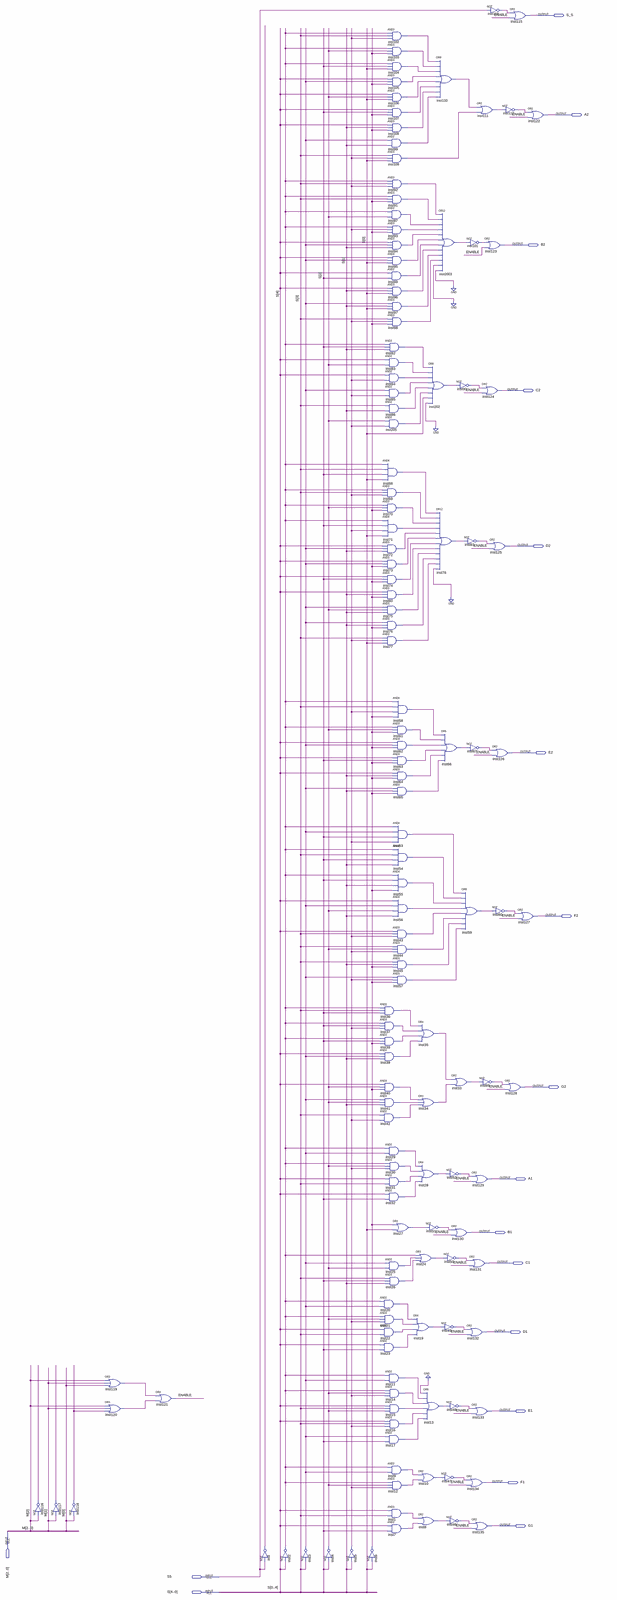
[diagram p0: schematic sheet, whole]
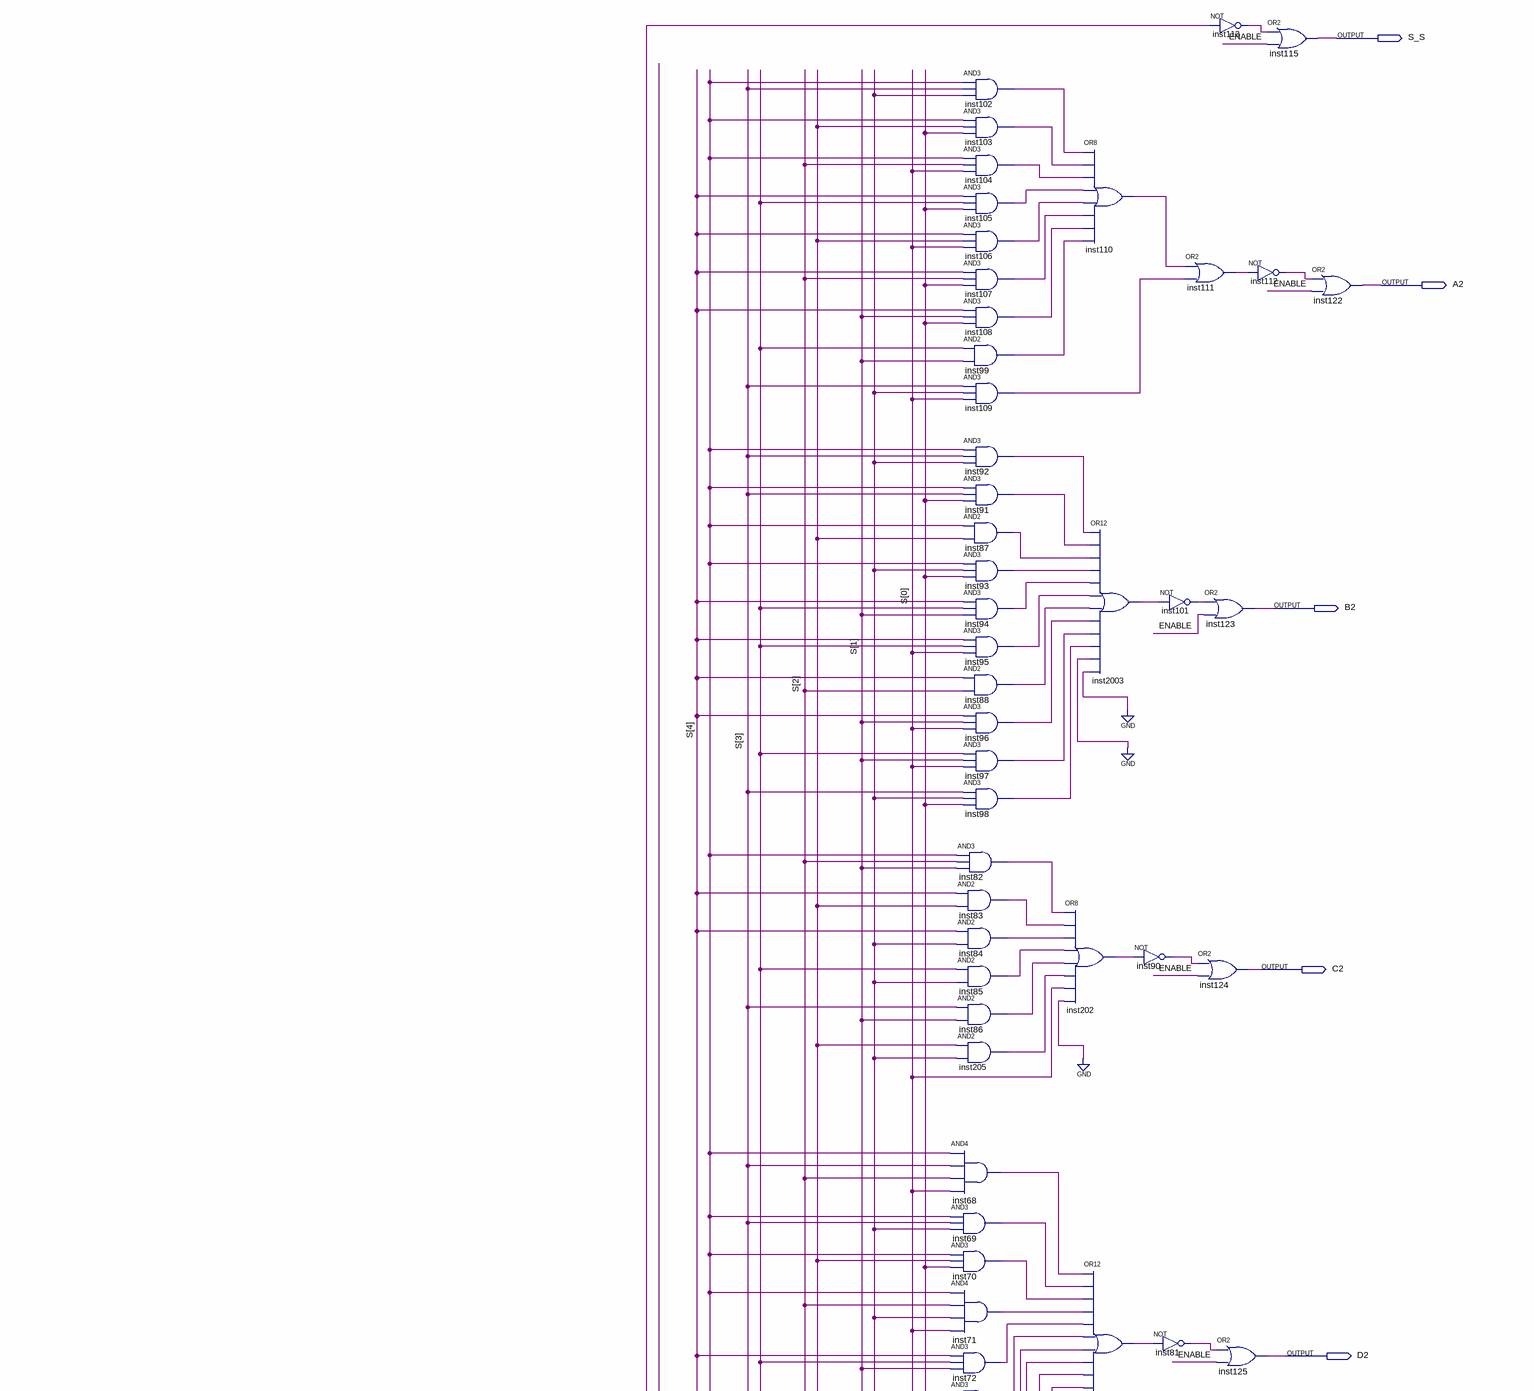
[diagram p1: schematic sheet, upper part]
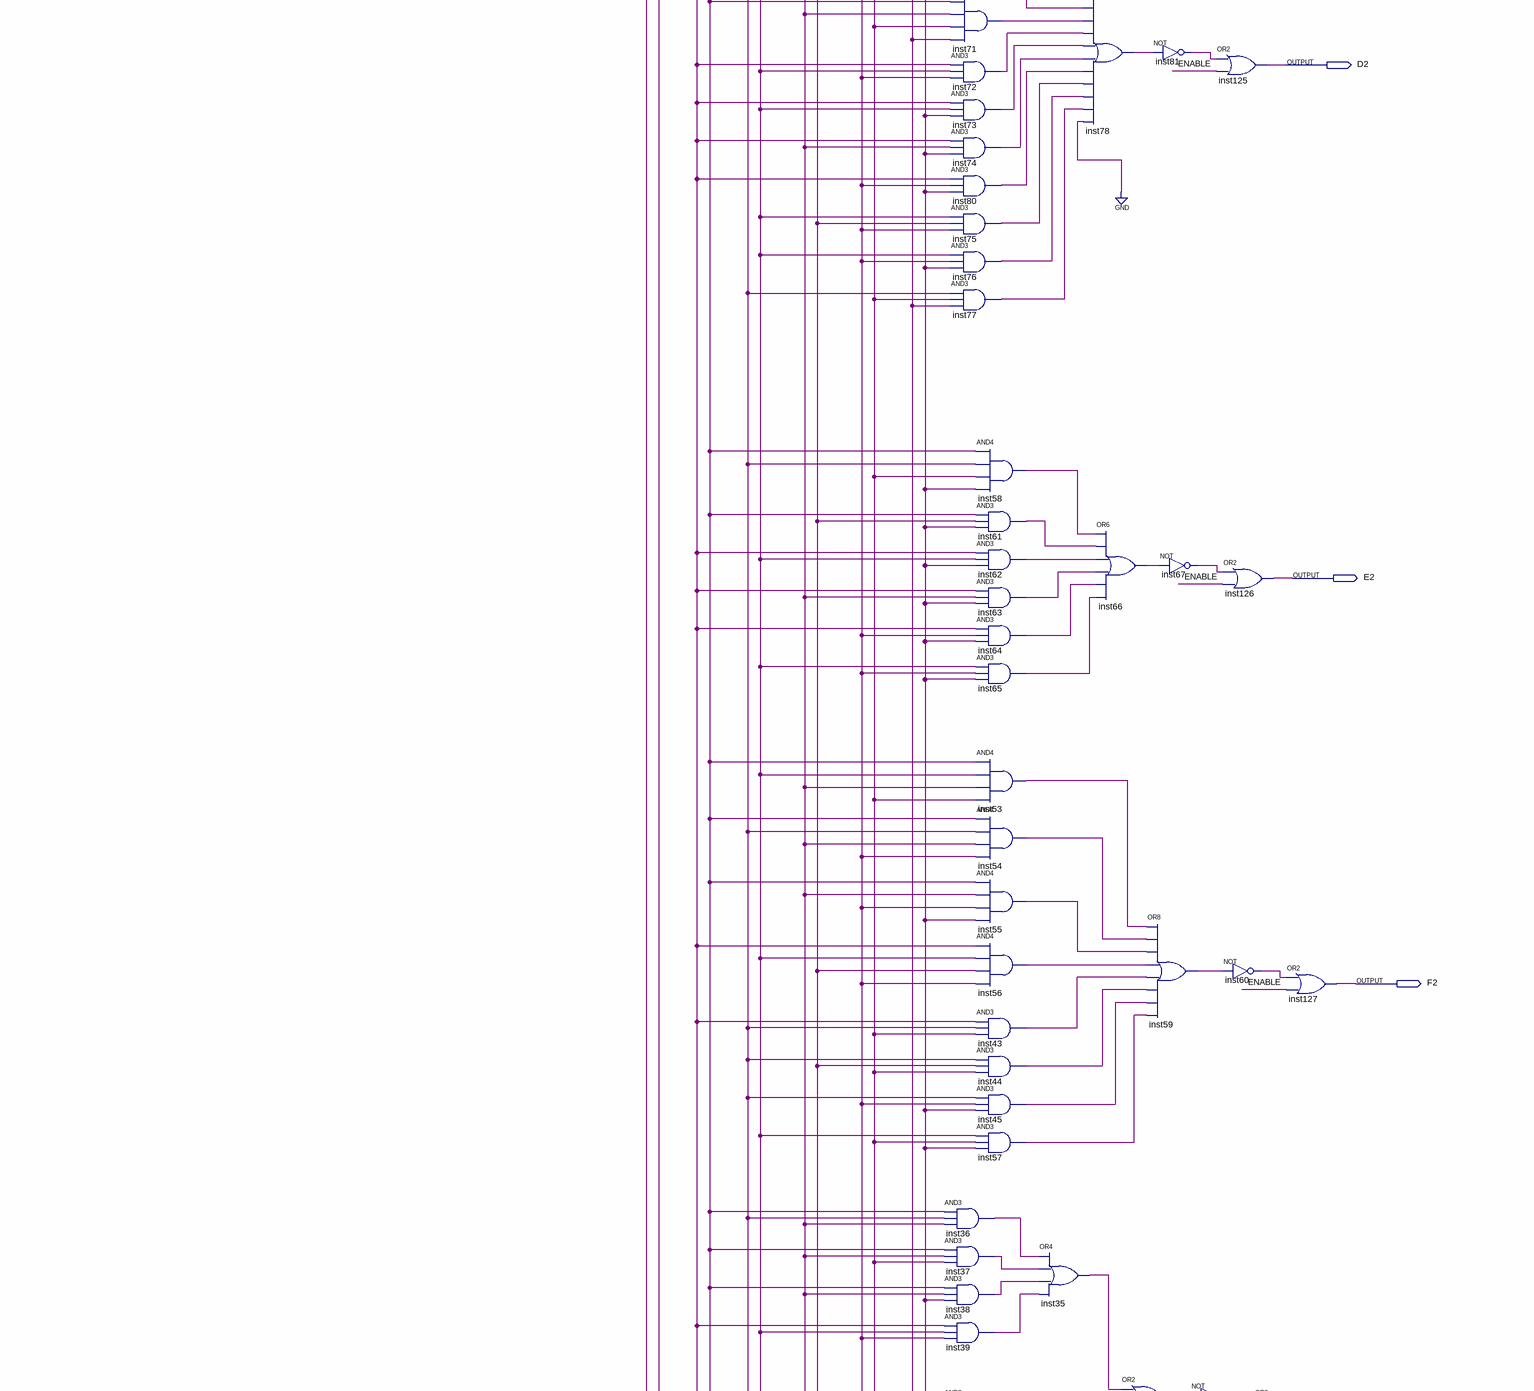
[diagram p2: schematic sheet, middle part]
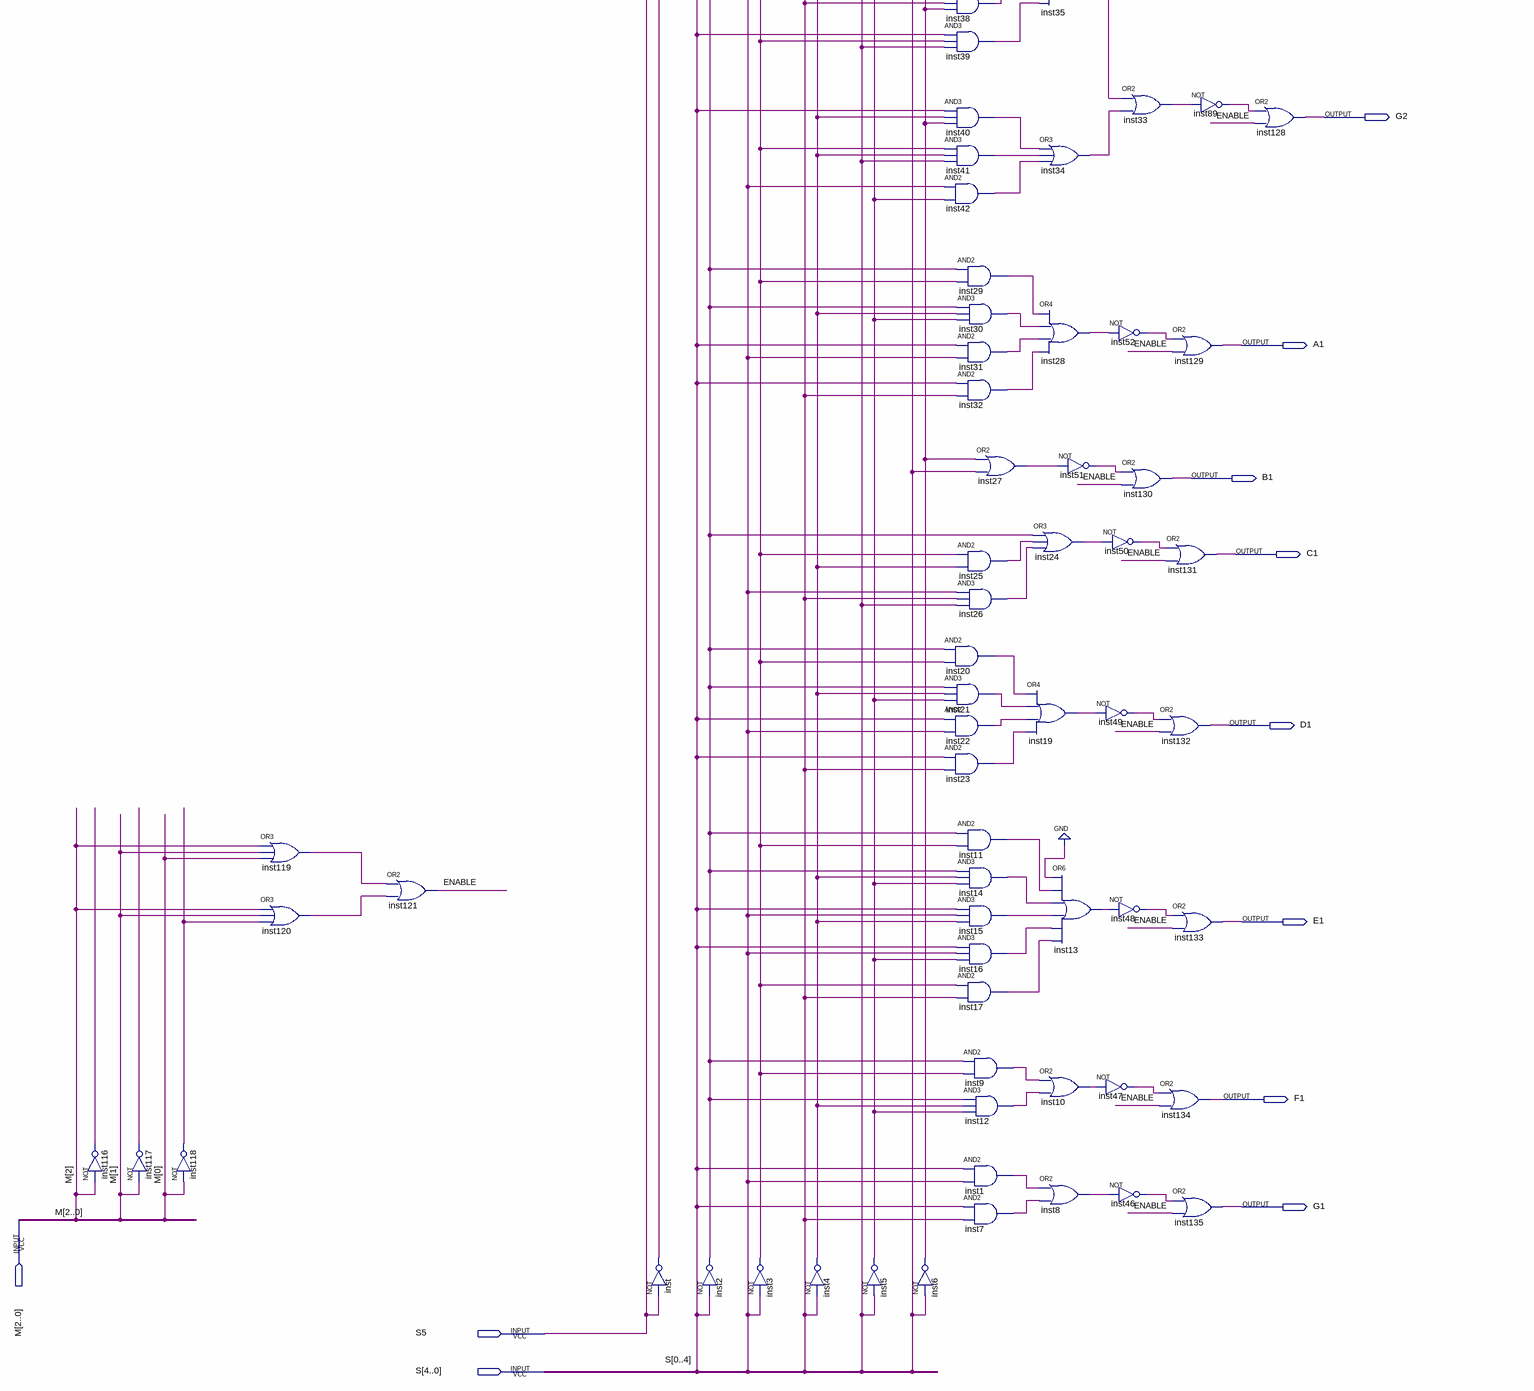
[diagram p3: schematic sheet, lower part]
// Quartus schematic decodificador5bitsDisplay.bdf as structural Verilog: 135 symbols, 18 pins
module decodificador5bitsDisplay (
  input  [2:0] M,
  input  S5,
  input  [4:0] S,
  output S_S,
  output A2,
  output B2,
  output C2,
  output D2,
  output E2,
  output F2,
  output G2,
  output A1,
  output B1,
  output C1,
  output D1,
  output E1,
  output F1,
  output G1
);

  wire ENABLE, inst1_out, inst2_out, inst3_out, inst4_out, inst5_out, inst6_out, inst7_out, inst8_out,
       inst9_out, inst10_out, inst11_out, inst12_out, inst13_out, inst14_out, inst15_out, inst16_out,
       inst17_out, inst19_out, inst20_out, inst21_out, inst22_out, inst23_out, inst24_out, inst25_out,
       inst26_out, inst27_out, inst28_out, inst29_out, inst30_out, inst31_out, inst32_out, inst33_out,
       inst34_out, inst35_out, inst36_out, inst37_out, inst38_out, inst39_out, inst40_out, inst41_out,
       inst42_out, inst43_out, inst44_out, inst45_out, inst46_out, inst47_out, inst48_out, inst49_out,
       inst50_out, inst51_out, inst52_out, inst53_out, inst54_out, inst55_out, inst56_out, inst57_out,
       inst58_out, inst59_out, inst60_out, inst61_out, inst62_out, inst63_out, inst64_out, inst65_out,
       inst66_out, inst67_out, inst68_out, inst69_out, inst70_out, inst71_out, inst72_out, inst73_out,
       inst74_out, inst75_out, inst76_out, inst77_out, inst78_out, inst80_out, inst81_out, inst82_out,
       inst83_out, inst84_out, inst85_out, inst86_out, inst87_out, inst88_out, inst89_out, inst90_out,
       inst91_out, inst92_out, inst93_out, inst94_out, inst95_out, inst96_out, inst97_out, inst98_out,
       inst99_out, inst101_out, inst102_out, inst103_out, inst104_out, inst105_out, inst106_out, inst107_out,
       inst108_out, inst109_out, inst110_out, inst111_out, inst112_out, inst113_out, inst116_out,
       inst117_out, inst118_out, inst119_out, inst120_out, inst202_out, inst205_out, inst2003_out, inst_out;

  not inst116 (inst116_out, M[2]);
  not inst117 (inst117_out, M[1]);
  not inst118 (inst118_out, M[0]);
  or inst119 (inst119_out, M[2], M[1], M[0]);
  or inst120 (inst120_out, M[2], M[1], inst118_out);
  or inst121 (ENABLE, inst119_out, inst120_out);
  not inst (inst_out, S5);
  not inst2 (inst2_out, S[4]);
  not inst3 (inst3_out, S[3]);
  not inst4 (inst4_out, S[2]);
  not inst5 (inst5_out, S[1]);
  and inst82 (inst82_out, inst2_out, S[2], S[1]);
  and inst83 (inst83_out, S[4], inst4_out);
  and inst84 (inst84_out, S[4], inst5_out);
  and inst85 (inst85_out, inst3_out, inst5_out);
  and inst86 (inst86_out, S[3], S[1]);
  and inst205 (inst205_out, inst4_out, inst5_out);
  and inst68 (inst68_out, inst2_out, S[3], S[2], S[0]);
  and inst69 (inst69_out, inst2_out, S[3], inst5_out);
  and inst70 (inst70_out, inst2_out, inst4_out, inst6_out);
  and inst71 (inst71_out, inst2_out, S[2], inst5_out, S[0]);
  and inst72 (inst72_out, S[4], inst3_out, S[1]);
  and inst73 (inst73_out, S[4], inst3_out, inst6_out);
  and inst74 (inst74_out, S[4], S[2], inst6_out);
  and inst80 (inst80_out, S[4], S[1], inst6_out);
  and inst75 (inst75_out, inst3_out, inst4_out, S[1]);
  and inst76 (inst76_out, inst3_out, S[1], inst6_out);
  and inst77 (inst77_out, S[3], inst5_out, S[0]);
  and inst36 (inst36_out, inst2_out, S[3], S[2]);
  and inst37 (inst37_out, inst2_out, S[2], inst5_out);
  and inst38 (inst38_out, inst2_out, S[2], inst6_out);
  and inst39 (inst39_out, S[4], inst3_out, S[1]);
  and inst40 (inst40_out, S[4], inst4_out, inst6_out);
  and inst41 (inst41_out, inst3_out, inst4_out, S[1]);
  and inst42 (inst42_out, S[3], inst5_out);
  and inst29 (inst29_out, inst2_out, inst3_out);
  and inst30 (inst30_out, inst2_out, inst4_out, inst5_out);
  and inst31 (inst31_out, S[4], S[3]);
  and inst32 (inst32_out, S[4], S[2]);
  and inst25 (inst25_out, inst3_out, inst4_out);
  and inst26 (inst26_out, S[3], S[2], S[1]);
  and inst20 (inst20_out, inst2_out, inst3_out);
  and inst21 (inst21_out, inst2_out, inst4_out, inst5_out);
  and inst22 (inst22_out, S[4], S[3]);
  and inst23 (inst23_out, S[4], S[2]);
  and inst11 (inst11_out, inst2_out, inst3_out);
  and inst14 (inst14_out, inst2_out, inst4_out, inst5_out);
  and inst15 (inst15_out, S[4], S[3], inst4_out);
  and inst16 (inst16_out, S[4], S[3], inst5_out);
  and inst17 (inst17_out, inst3_out, S[2]);
  not inst6 (inst6_out, S[0]);
  and inst102 (inst102_out, inst2_out, S[3], inst5_out);
  and inst103 (inst103_out, inst2_out, inst4_out, inst6_out);
  and inst104 (inst104_out, inst2_out, S[2], S[0]);
  and inst105 (inst105_out, S[4], inst3_out, inst6_out);
  and inst106 (inst106_out, S[4], inst4_out, S[0]);
  and inst107 (inst107_out, S[4], S[2], inst6_out);
  and inst108 (inst108_out, S[4], S[1], inst6_out);
  and inst99 (inst99_out, inst3_out, S[1]);
  and inst109 (inst109_out, S[3], inst5_out, S[0]);
  and inst92 (inst92_out, inst2_out, S[3], inst5_out);
  and inst91 (inst91_out, inst2_out, S[3], inst6_out);
  and inst87 (inst87_out, inst2_out, inst4_out);
  and inst93 (inst93_out, inst2_out, inst5_out, inst6_out);
  and inst94 (inst94_out, S[4], inst3_out, S[1]);
  and inst95 (inst95_out, S[4], inst3_out, S[0]);
  and inst88 (inst88_out, S[4], S[2]);
  and inst96 (inst96_out, S[4], S[1], S[0]);
  and inst97 (inst97_out, inst3_out, S[1], S[0]);
  and inst98 (inst98_out, S[3], inst5_out, inst6_out);
  and inst58 (inst58_out, inst2_out, S[3], inst5_out, inst6_out);
  and inst61 (inst61_out, inst2_out, inst4_out, inst6_out);
  and inst62 (inst62_out, S[4], inst3_out, inst6_out);
  and inst63 (inst63_out, S[4], S[2], inst6_out);
  and inst64 (inst64_out, S[4], S[1], inst6_out);
  and inst65 (inst65_out, inst3_out, S[1], inst6_out);
  and inst53 (inst53_out, inst2_out, inst3_out, S[2], inst5_out);
  and inst54 (inst54_out, inst2_out, S[3], S[2], S[1]);
  and inst55 (inst55_out, inst2_out, S[2], S[1], inst6_out);
  and inst56 (inst56_out, S[4], inst3_out, inst4_out, S[1]);
  and inst43 (inst43_out, S[4], S[3], inst5_out);
  and inst44 (inst44_out, S[3], inst4_out, inst5_out);
  and inst45 (inst45_out, S[3], S[1], inst6_out);
  and inst57 (inst57_out, inst3_out, inst5_out, inst6_out);
  or inst27 (inst27_out, inst6_out, S[0]);
  and inst9 (inst9_out, inst2_out, inst3_out);
  and inst12 (inst12_out, inst2_out, inst4_out, inst5_out);
  and inst1 (inst1_out, S[4], S[3]);
  and inst7 (inst7_out, S[4], S[2]);
  or inst35 (inst35_out, inst36_out, inst37_out, inst38_out, inst39_out);
  or inst34 (inst34_out, inst40_out, inst41_out, inst42_out);
  or inst28 (inst28_out, inst29_out, inst30_out, inst31_out, inst32_out);
  not inst51 (inst51_out, inst27_out);
  or inst24 (inst24_out, inst2_out, inst25_out, inst26_out);
  or inst19 (inst19_out, inst20_out, inst21_out, inst22_out, inst23_out);
  or inst13 (inst13_out, 1'b0, inst11_out, inst14_out, inst15_out, inst16_out, inst17_out);
  or inst10 (inst10_out, inst9_out, inst12_out);
  or inst8 (inst8_out, inst1_out, inst7_out);
  or inst110 (inst110_out, inst102_out, inst103_out, inst104_out, inst105_out, inst106_out, inst107_out, inst108_out, inst99_out);
  or inst2003 (inst2003_out, inst92_out, inst91_out, inst87_out, inst93_out, inst94_out, inst95_out, inst88_out, inst96_out, inst97_out, inst98_out, 1'b0, 1'b0);
  or inst202 (inst202_out, inst82_out, inst83_out, inst84_out, inst85_out, inst86_out, inst205_out, S[0], 1'b0);
  or inst78 (inst78_out, inst68_out, inst69_out, inst70_out, inst71_out, inst72_out, inst73_out, inst74_out, inst80_out, inst75_out, inst76_out, inst77_out, 1'b0);
  or inst66 (inst66_out, inst58_out, inst61_out, inst62_out, inst63_out, inst64_out, inst65_out);
  not inst52 (inst52_out, inst28_out);
  not inst50 (inst50_out, inst24_out);
  not inst49 (inst49_out, inst19_out);
  not inst48 (inst48_out, inst13_out);
  not inst47 (inst47_out, inst10_out);
  not inst46 (inst46_out, inst8_out);
  not inst101 (inst101_out, inst2003_out);
  not inst90 (inst90_out, inst202_out);
  not inst81 (inst81_out, inst78_out);
  not inst67 (inst67_out, inst66_out);
  or inst59 (inst59_out, inst53_out, inst54_out, inst55_out, inst56_out, inst43_out, inst44_out, inst45_out, inst57_out);
  or inst33 (inst33_out, inst35_out, inst34_out);
  or inst130 (B1, inst51_out, ENABLE);
  or inst132 (D1, inst49_out, ENABLE);
  or inst134 (F1, inst47_out, ENABLE);
  not inst113 (inst113_out, S5);
  or inst111 (inst111_out, inst110_out, inst109_out);
  or inst123 (B2, inst101_out, ENABLE);
  or inst124 (C2, inst90_out, ENABLE);
  not inst89 (inst89_out, inst33_out);
  or inst129 (A1, inst52_out, ENABLE);
  or inst131 (C1, inst50_out, ENABLE);
  or inst133 (E1, inst48_out, ENABLE);
  or inst135 (G1, inst46_out, ENABLE);
  not inst112 (inst112_out, inst111_out);
  or inst125 (D2, inst81_out, ENABLE);
  or inst126 (E2, inst67_out, ENABLE);
  not inst60 (inst60_out, inst59_out);
  or inst128 (G2, inst89_out, ENABLE);
  or inst115 (S_S, inst113_out, ENABLE);
  or inst122 (A2, inst112_out, ENABLE);
  or inst127 (F2, inst60_out, ENABLE);
endmodule
